# EAGLE design MicroBlue_1.0_rdob-millable (EAGLE 6.6.0)
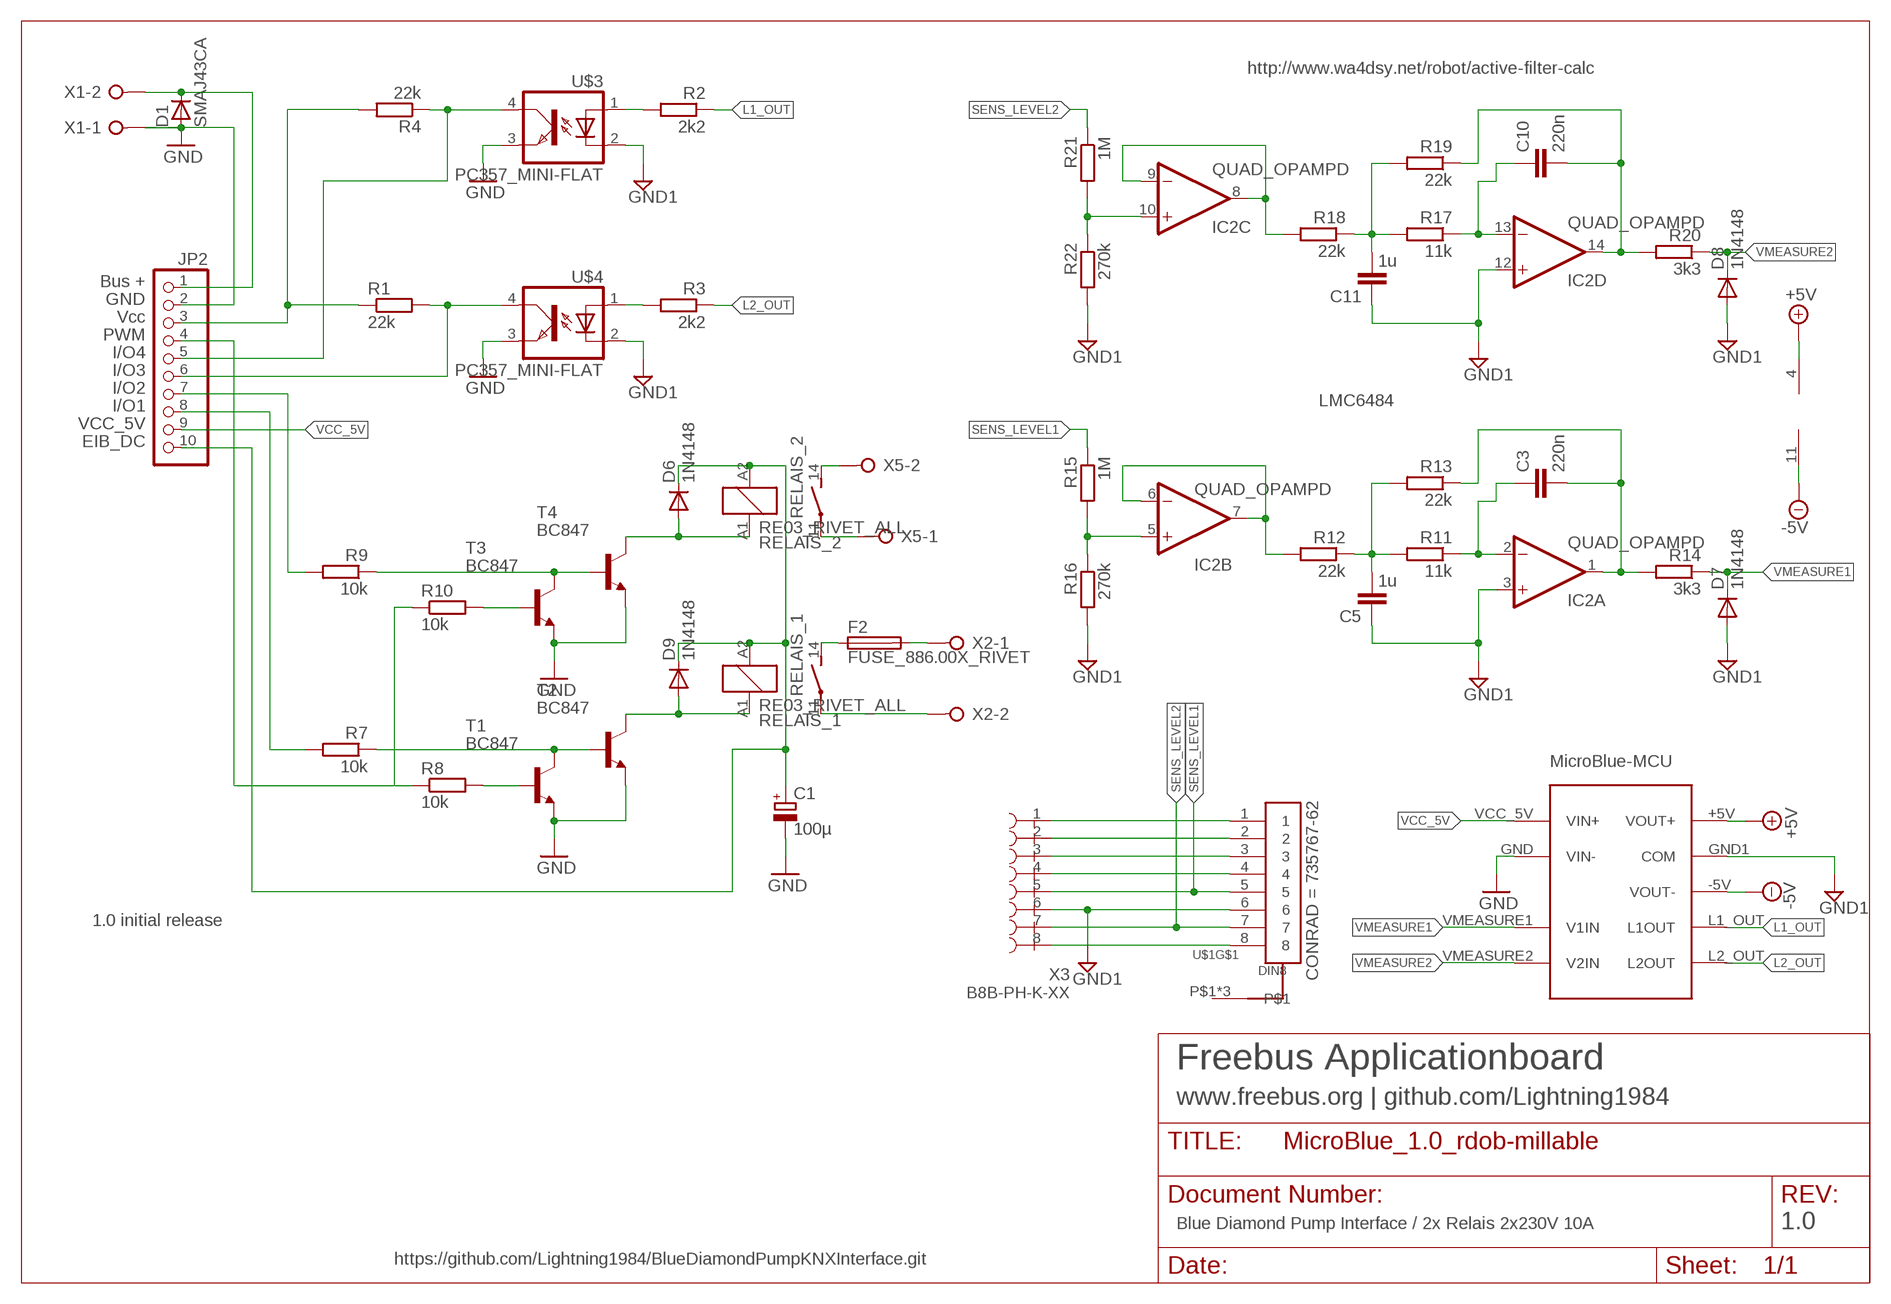
[diagram p0: schematic, sheet 1]

## Parts
C1  100µ  CPOL-EUE3.5-8  [E3,5-8]
C3  220n  C-EUC0805K  [C0805K]
C5  1u  C-EUC0805K  [C0805K]
C10  220n  C-EUC0805K  [C0805K]
C11  1u  C-EUC0805K  [C0805K]
D1  SMAJ43CA  D-SMB  [SMB]
D6  1N4148  DIODE-MINIMELF  [MINIMELF]
D7  1N4148  DIODE-MINIMELF  [MINIMELF]
D8  1N4148  DIODE-MINIMELF  [MINIMELF]
D9  1N4148  DIODE-MINIMELF  [MINIMELF]
F2  FUSE_886.00X_RIVET  [886.00X_RIVET]
IC2  QUAD_OPAMPD  [SO14]
JP2  PINHD-1X10_2.54-S0.90MM-DRILL  [1X10-0.90DRILL]
R1  22k  R-EU_M1206  [M1206]
R2  2k2  R-EU_M1206  [M1206]
R3  2k2  R-EU_M1206  [M1206]
R4  22k  R-EU_M1206  [M1206]
R7  10k  R-EU_M1206  [M1206]
R8  10k  R-EU_M1206  [M1206]
R9  10k  R-EU_M1206  [M1206]
R10  10k  R-EU_M1206  [M1206]
R11  11k  R-EU_M1206  [M1206]
R12  22k  R-EU_M1206  [M1206]
R13  22k  R-EU_M1206  [M1206]
R14  3k3  R-EU_M1206  [M1206]
R15  1M  R-EU_M1206  [M1206]
R16  270k  R-EU_M1206  [M1206]
R17  11k  R-EU_M1206  [M1206]
R18  22k  R-EU_M1206  [M1206]
R19  22k  R-EU_M1206  [M1206]
R20  3k3  R-EU_M1206  [M1206]
R21  1M  R-EU_M1206  [M1206]
R22  270k  R-EU_M1206  [M1206]
RELAIS_1  RE03_RIVET_ALL  [G5Q-SPST-RIVET-ALL]
RELAIS_2  RE03_RIVET_ALL  [G5Q-SPST-RIVET-ALL]
T1  BC847  [SOT23]
T2  BC847  [SOT23]
T3  BC847  [SOT23]
T4  BC847  [SOT23]
U$1  DIN8  [DIN8]
U$3  PC357_MINI-FLAT  [PC357]
U$4  PC357_MINI-FLAT  [PC357]
U$5  MICROBLUE-MCU_V2  [MICROBLUE-MCU-V2]
X1  W237-02PNORMAL  [W237-132]
X2  W237-02P_RIVET  [W237-132-RIVET]
X3  B8B-PH-K-XX  [B8B-PH-K-XX]
X5  W237-02P_RIVET  [W237-132-RIVET]

## Nets
+5V: IC2.4(P:V+) U$5.+5V(VOUT+)
-5V: IC2.11(P:V-) U$5.-5V(VOUT-)
EIB+: D1.1(C) JP2.1 X1.2
EIB_DC: C1.+ D6.C D9.C JP2.10 RELAIS_1.A2 RELAIS_2.A2
GND: C1.- D1.2(A) JP2.2 T1.2(E) T2.2(E) T3.2(E) T4.2(E) U$3.3(EMIT) U$4.3(EMIT) U$5.GND(VIN-) X1.1
GND1: C5.1 C11.1 D7.A D8.A IC2.3(A:+IN) IC2.12(D:+IN) R16.2 R22.2 U$1.6 U$3.2(C) U$4.2(C) U$5.GND1(COM) X3.6
IO1: JP2.7 R9.2
IO2: JP2.8 R7.2
IO3: JP2.6 R1.2 U$4.4(COL)
IO4: JP2.5 R4.1 U$3.4(COL)
L1_OUT: R2.1 U$5.L1_OUT(L1OUT)
L2_OUT: R3.1 U$5.L2_OUT(L2OUT)
N$1: U$1.1 X3.1
N$2: RELAIS_1.11(2:P) X2.2
N$3: U$1.2 X3.2
N$4: U$1.4 X3.4
N$5: U$1.3 X3.3
N$6: F2.1 RELAIS_1.14(2:S)
N$7: U$1.8 X3.8
N$8: RELAIS_2.14(2:S) X5.2
N$9: RELAIS_2.11(2:P) X5.1
N$10: F2.2 X2.1
N$11: C5.2 R11.2 R12.1 R13.2
N$12: R2.2 U$3.1(A)
N$13: R3.2 U$4.1(A)
N$14: R7.1 T1.3(C) T2.1(B)
N$16: C3.2 IC2.1(A:OUT) R13.1 R14.2
N$17: R9.1 T3.3(C) T4.1(B)
N$19: D6.A RELAIS_2.A1 T4.3(C)
N$21: R8.2 T1.1(B)
N$22: R10.2 T3.1(B)
N$23: C3.1 IC2.2(A:-IN) R11.1
N$30: IC2.6(B:-IN) IC2.7(B:OUT) R12.2
N$31: IC2.5(B:+IN) R15.2 R16.1
N$33: C11.2 R17.2 R18.1 R19.2
N$34: C10.2 IC2.14(D:OUT) R19.1 R20.2
N$35: C10.1 IC2.13(D:-IN) R17.1
N$36: IC2.8(C:OUT) IC2.9(C:-IN) R18.2
N$37: IC2.10(C:+IN) R21.2 R22.1
PWM: JP2.4 R8.1 R10.1
R3: D9.A RELAIS_1.A1 T2.3(C)
SENS_LEVEL1: R15.1 U$1.5 X3.5
SENS_LEVEL2: R21.1 U$1.7 X3.7
VCC: JP2.3 R1.1 R4.2
VCC_5V: JP2.9 U$5.VCC_5V(VIN+)
VMEASURE1: D7.C R14.1 U$5.VMEASURE1(V1IN)
VMEASURE2: D8.C R20.1 U$5.VMEASURE2(V2IN)
Unconnected: U$1.P$1 U$1.P$2 U$1.P$3

## Notes on the sheet
- http://www.wa4dsy.net/robot/active-filter-calc
- Bus +
- GND
- Vcc
- PWM
- I/O4
- I/O3
- I/O2
- I/O1
- VCC_5V
- EIB_DC
- 1.0 initial release
- Freebus Applicationboard
- www.freebus.org | github.com/Lightning1984
- Blue Diamond Pump Interface / 2x Relais 2x230V 10A | 1.0
- https://github.com/Lightning1984/BlueDiamondPumpKNXInterface.git

## Library data of the parts
C1 = rcl:CPOL-EU: POLARIZED CAPACITOR, European symbol
C3 C5 C10 C11 = rcl:C-EU: CAPACITOR, European symbol
D1 = semicon-smd-ipc:D-: DIODE unfilled
D6-D9 = diode:DIODE-: DIODE
F2 = rdob-devices:FUSE: various fuses
IC2 = adafruit-2:QUAD_OPAMP: OP AMP Standard quad package; TYPE: LMC6484
JP2 = pinhead-2:PINHD-1X10: PIN HEADER
R1-R4 R7-R22 = rcl:R-EU_: RESISTOR, European symbol
RELAIS_1 RELAIS_2 = relay-modified:RE03*: Miniature PCB Relay 1 pole 6 A SCHRACK Source: http://www.schrack.com/.. 5812.pdf
T1-T4 = transistor:BC847: NPN TRANSISTOR
U$1 = rdob-devices:DIN8; CONRAD: 735767-62
U$3 U$4 = optocoupler:PC357
U$5 = rdob-devices:MICROBLUE-MCU
X1 = con-wago-508:W237-02P: WAGO SREW CLAMP; OC_FARNELL: unknown; OC_NEWARK: unknown
X2 X5 = con-wago-508:W237-02P: WAGO SREW CLAMP
X3 = jst_2.0mm:B8B-PH-K-XX: JST PH Family Series Connector Manufacturer: JST Grid: 2.00mm Farbendeklaration Der letzte (bzw. die letzten) zwei Ziffern beschreiben die Farbe des Steckers. z.B.: B2B-PH-K-xx: S ... natural (white) K ... black R ... red TR ... tomato red E ... blue Y ... yellow L ... lemon yellow M ... green O ... orange N ... brown P ... purple PK ... pink H ... gray LE ... light blue FY ... vivid yellow (blank) ... ivory

## Board
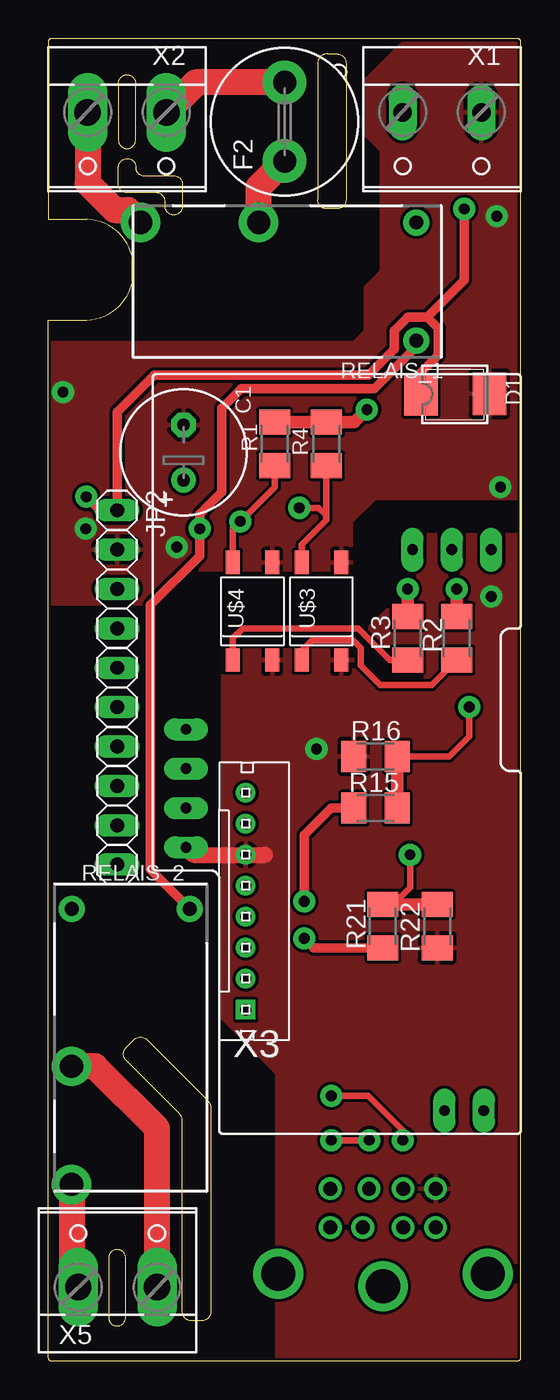
[diagram p1: board, top side]
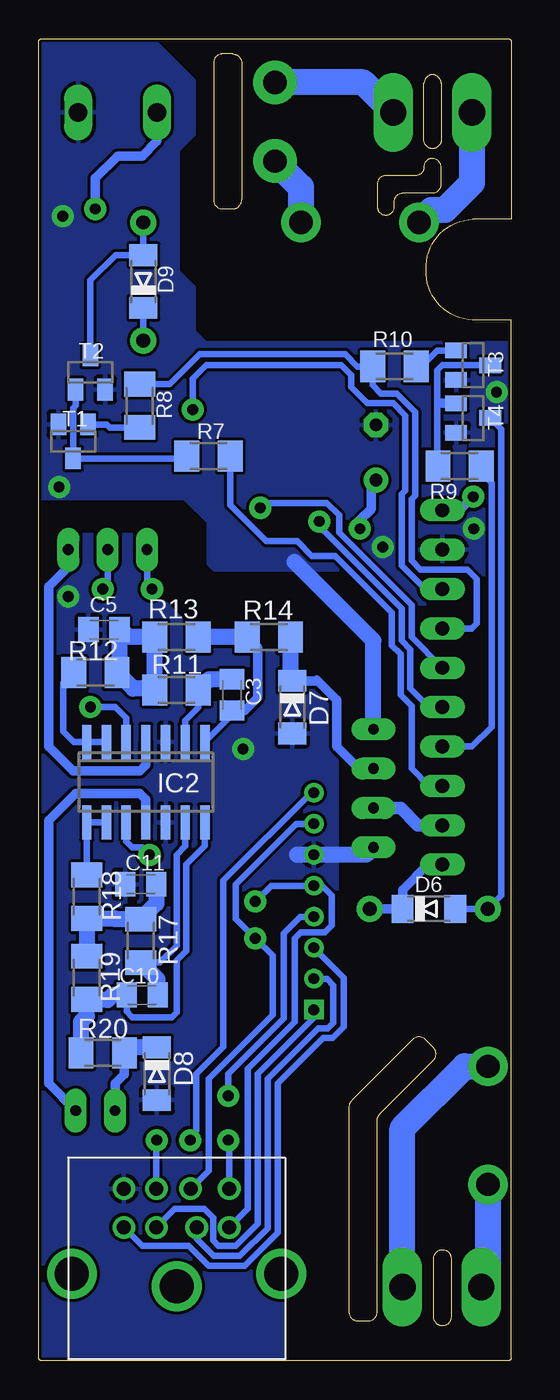
[diagram p2: board, bottom side, seen from below]

Size 30.48 x 85.3 mm. Coordinates in mm from the lower left corner, seen from the top.
Outline: 0,0.2 0,67.15 2.5,67.15 arc90 5.5,70.4 arc90 2.5,73.65 0,73.65 0,85.1 arc-90 0.2,85.3 30.28,85.3 arc-90 30.48,85.1 30.48,0.2 arc-90 30.28,0 0.2,0 arc-90 0,0.2
Copper layers (1*16): Top 0.035mm / dielectric 1.5mm / Bottom 0.035mm
Design rules "default_freebus *": minimum track width 12mil, minimum drill 0.5mm, track to track 0.2mm, track to pad 0.2mm, pad to pad 0.2mm, via to via 0.2mm, smd to smd 0.2mm, copper to edge 0.2mm, drill to drill 8mil, minimum pad ring 11mil, minimum via ring 8mil, stop-mask expansion 4mil, vias tented up to drill 0mil, thermal gap 10mil
tRestrict: area -0.3,65.8 to 23.2,85.5; area -0.3,-0.2 to 30.8,55.5
bRestrict: area -0.3,65.8 to 23.2,85.5; area -0.3,-0.2 to 30.8,55.5
Milling: 51 lines

### Footprints (pad centres in the part's own frame; a part is rotated, then mirrored left to right if it is on the bottom)
E3,5-8 = drill 0.813 pad 1.6: + -1.778,0 | drill 0.813 pad 1.6 octagon: - 1.778,0
C0805K = smd 1.3 x 1.6: 1 -1,0; 2 1,0
SMB = smd 2.159 x 2.743: 1 -2.311,-0.127; 2 2.108,-0.102
MINIMELF = smd 1.4 x 1.8: A 1.7,0; C -1.7,0
886.00X_RIVET = drill 1.5 pad 2.8: 1 -2.54,0; 2 2.54,0
SO14 = smd 0.6 x 2.2: 1 -3.81,-2.6; 2 -2.54,-2.6; 3 -1.27,-2.6; 4 0,-2.6; 5 1.27,-2.6; 6 2.54,-2.6; 7 3.81,-2.6; 8 3.81,2.6; 9 2.54,2.6; 10 1.27,2.6; 11 0,2.6; 12 -1.27,2.6; 13 -2.54,2.6; 14 -3.81,2.6
1X10-0.90DRILL = drill 0.9 pad 1.422 long: 1 -11.43,0; 2 -8.89,0; 3 -6.35,0; 4 -3.81,0; 5 -1.27,0; 6 1.27,0; 7 3.81,0; 8 6.35,0; 9 8.89,0; 10 11.43,0
M1206 = smd 1.6 x 2: 1 -1.4,0; 2 1.4,0
G5Q-SPST-RIVET-ALL = drill 1.5 pad 2.54: 11 8.89,-3.81; 14 1.27,-3.81 | drill 0.9 pad 1.676: A1 -8.89,-3.81; A2 -8.89,3.81
SOT23 = smd 1 x 1.4: 1 -0.95,-1.1; 2 0.95,-1.1; 3 0,1.1
DIN8 = drill 0.9: 1 1.3,8.5; 2 -1.3,8.5; 3 3.4,8.5; 4 1.3,11; 5 -3.4,8.5; 6 3.4,11; 7 -0.9,11; 8 -3.4,11 | drill 2.2: P$1 0,4.7; P$2 -6.75,5.5; P$3 6.75,5.5
PC357 = smd 0.9 x 1.5: 1 -1.27,-3.15; 2 1.27,-3.15; 3 1.27,3.15; 4 -1.27,3.15
MICROBLUE-MCU-V2 = drill 0.7 pad 1.422 long: +5V 13.335,9.684; -5V 12.859,-26.511; GND -6.35,-1.905; GND1 -6.35,-9.525; L1_OUT 10.795,9.684; L2_OUT 8.255,9.684; VCC_5V -6.35,-6.985; VMEASURE1 -6.35,-4.445; VMEASURE2 10.319,-26.511
W237-132 = drill 1.194 long: 1 -2.54,0; 2 2.54,0
W237-132-RIVET = drill 1.7 pad 1.93 long: 1 -2.54,0; 2 2.54,0
B8B-PH-K-XX = drill 0.7 square: 1 0,0 | drill 0.7: 2 2,0; 3 4,0; 4 6,0; 5 8,0; 6 10,0; 7 12,0; 8 14,0

### Placement (x,y rotation side)
C1  8.73,58.6 90 top
C3  18.02,42.97 270 bottom
C5  26.27,47.17 0 bottom
C10  23.81,23.6 180 bottom
C11  23.89,30.74 0 bottom
D1  26.35,62.49 0 top
D6  5.32,29.16 0 bottom
D7  14.13,42.17 270 bottom
D8  22.86,18.52 270 bottom
D9  23.73,69.64 90 bottom
F2  15.25,79.95 90 top
IC2  23.57,37.33 180 bottom
JP2  4.45,43.44 270 top
R1  14.61,59.16 270 top
R2  26.35,46.62 270 top
R3  23.18,46.62 270 top
R4  17.94,59.16 90 top
R7  19.53,58.37 0 bottom
R8  23.97,61.62 270 bottom
R9  3.33,57.73 0 bottom
R10  7.54,64.16 0 bottom
R11  21.59,43.28 180 bottom
R12  26.83,44.4 180 bottom
R13  21.59,46.7 180 bottom
R14  15.64,46.7 180 bottom
R15  21.11,35.66 0 top
R16  21.11,39 180 top
R17  23.89,27.09 90 bottom
R18  27.38,29.95 90 bottom
R19  27.38,24.71 90 bottom
R20  26.35,19.87 180 bottom
R21  21.59,28.04 90 top
R22  25.08,28.04 270 top
RELAIS_1  14.84,69.64 180 top
RELAIS_2  5.32,20.27 270 top
T1  28.26,59.32 180 bottom
T2  27.15,63.76 0 bottom
T3  2.46,64.24 270 bottom
T4  2.46,60.83 270 bottom
U$1  21.59,0.1 0 top
U$3  17.62,48.36 0 top
U$4  13.18,48.36 0 top
U$5  15.24,42.65 0 top
X1  25.4,80.55 180 top
X2  5.08,80.55 180 top
X3  12.74,22.65 90 top
X5  4.48,4.75 0 top

### Tracks (layer width: path | path; a pad name or v marks a point on that pad's centre or on a via)
+5V
  Bottom 0.61: IC2.4 23.57,38.44 23.97,38.05 28.26,38.05 29.84,39.63 29.84,49.95 28.58,51.22 U$5.+5V
-5V
  Bottom 0.61: IC2.11 23.57,36.22 23.97,36.62 28.1,36.62 29.84,34.87 29.84,17.88 U$5.-5V
EIB+  (via drill 0.7 pad 1.42)
  Top 0.61: 24.45,67.34 23.18,67.34 22.3,66.46 22.3,65.27 20.64,63.6 6.83,63.6 4.45,61.22 JP2.1 3.33,54.87 v2.46,55.75 | 24.45,67.34 25.16,66.62 25.16,64.88 24.04,63.75 D1.1 | v26.83,74.32 26.83,69.72 24.45,67.34
  Bottom 0.61: v2.46,55.75 3.33,54.87 JP2.1 | X1.2 22.86,78.69 23.81,77.73 25.4,77.73 26.83,76.31 v26.83,74.32
EIB_DC  (via drill 0.7 pad 1.42)
  Top 0.61: RELAIS_2.A2 6.59,31.7 6.59,48.76 9.76,51.94 v9.76,53.68 9.76,54.64 11.19,56.06 11.19,61.46 12.46,62.73 21.03,62.73 23.73,65.43 RELAIS_1.A2
  Bottom 0.406: RELAIS_1.A2 D9.C
  Bottom 0.61: RELAIS_2.A2 D6.C 7.02,30.39 5.4,32.01 JP2.10 | v9.76,53.68 9.76,54.24 9.05,54.95 9.05,56.51 C1.+
GND  (via drill 0.7 pad 1.42)
  Bottom 1.016: U$5.GND 8.89,46.46 13.97,51.54
  other vias: 2.42,53.68 8.29,52.49 28.93,73.84 0.95,62.49 29.17,56.38
  pour Top: 20.32,82.66 20.32,66.46 19.69,65.83 -0.32,65.83 -0.32,48.68 6.35,48.68 8.57,50.91 19.21,50.91 19.69,51.38 19.69,54.08 21.11,55.51 30.8,55.51 30.8,85.83 23.5,85.83
  pour Bottom: 20.32,82.66 20.32,66.46 19.69,65.83 -0.32,65.83 -0.32,48.68 6.35,48.68 8.57,50.91 19.21,50.91 19.69,51.38 19.69,54.08 21.11,55.51 30.8,55.51 30.8,85.83 23.5,85.83
GND1  (via drill 0.7 pad 1.42)
  Top 1.016: U$5.GND1 9.37,32.65 13.97,32.65
  Bottom 1.016: U$5.GND1 9.37,32.65 X3.6 | 12.7,32.65 13.81,32.65
  other vias: 28.58,49.32 17.3,39.48
  pour Top: 11.11,45.51 11.59,45.98 19.21,45.98 22.38,49.16 22.38,52.81 23.02,53.45 30.8,53.45 30.8,-0.21 14.76,-0.21 14.61,-0.05 14.61,18.52 11.11,22.01
  pour Bottom: 11.11,45.51 11.59,45.98 19.21,45.98 22.38,49.16 22.38,52.81 23.02,53.45 30.8,53.45 30.8,-0.21 14.76,-0.21 14.61,-0.05 14.61,18.52 11.11,22.01
IO1
  Bottom 0.406: JP2.7 2.54,39.63 1.27,40.9 1.27,56.62 1.9,57.25 | 1.9,57.25 2.25,57.6 | 1.9,57.25 1.9,57.7 R9.2
IO2
  Bottom 0.406: JP2.8 5.32,37.09 6.43,38.2 6.43,42.25 7.14,42.97 7.14,45.59 7.7,46.14 7.7,48.29 11.35,51.94 12.86,51.94 13.81,52.89 15.8,52.89 18.13,55.22 R7.2
IO3  (via drill 0.7 pad 1.42)
  Top 0.406: U$4.4 11.91,53.68 v12.38,54.16 14.61,56.38 R1.2
  Bottom 0.406: JP2.6 5.32,42.17 6.51,43.36 6.51,45.9 7.06,46.46 7.06,48.52 12.38,53.84 v12.38,54.16
IO4  (via drill 0.7 pad 1.42)
  Top 0.406: U$3.4 16.35,52.65 17.94,54.24 17.94,54.56 | 17.94,54.56 R4.1 | v16.19,55.03 17.46,55.03 17.94,54.56
  Bottom 0.406: JP2.5 6.43,46.7 6.43,48.76 11.11,53.45 11.11,54.56 11.91,55.35 15.88,55.35 v16.19,55.03
L1_OUT  (via drill 0.7 pad 1.42)
  Top 0.813: R2.1 v26.35,49.79
  Bottom 0.406: U$5.L1_OUT 26.04,50.11 v26.35,49.79
L2_OUT  (via drill 0.7 pad 1.42)
  Top 0.813: v23.18,49.79 R3.1
  Bottom 0.406: U$5.L2_OUT 23.5,50.11 v23.18,49.79
N$1
  Bottom 0.406: X3.1 12.74,22.13 16.35,18.52 16.35,8.84 17.78,7.41 18.89,7.41 19.24,7.76 19.24,9.23 19.79,9.79 21.71,9.79 U$1.1
N$2
  Top 1.676: X2.2 2.54,75.99 4.29,74.24 5.16,74.24 RELAIS_1.11
  Bottom 1.676: X2.2 2.54,75.99 4.29,74.24 5.16,74.24 5.4,74 RELAIS_1.11
N$3
  Bottom 0.406: X3.2 11.89,24.65 11.47,24.23 11.47,21.81 11.83,21.46 12.46,21.46 15.72,18.2 15.72,8.56 17.5,6.77 19.21,6.77 20.29,7.85 U$1.2
N$4  (via drill 0.7 pad 1.42)
  Top 0.406: v18.26,17.09 20.64,17.09 22.86,14.87 v22.86,14.23
  Bottom 0.406: X3.4 13.6,28.65 14.68,27.57 14.68,22.09 18.26,18.52 v18.26,17.09 | U$1.4 22.89,14.2 v22.86,14.23
N$5
  Bottom 0.406: U$1.3 23.79,7.41 20.8,7.41 19.53,6.14 17.18,6.14 15.08,8.24 15.08,17.88 12.14,20.82 11.51,20.82 10.79,21.54 10.79,24.7 X3.3
N$6
  Top 1.676: RELAIS_1.14 13.57,75.74 F2.1
  Bottom 1.676: F2.1 13.57,75.73 RELAIS_1.14
N$7  (via drill 0.7 pad 1.42)
  Top 0.406: v18.26,14.23 v20.72,14.23
  Bottom 0.406: U$1.8 18.19,14.17 v18.26,14.23 | v20.72,14.23 20.72,14.47 20.32,14.87 20.32,18.52 18.57,20.27 18.57,30.98 12.91,36.65 X3.8
N$8
  Top 1.676: X5.2 7.02,14.99 3.02,19 1.35,19
  Bottom 1.676: X5.2 7.02,14.99 3.02,19 RELAIS_2.14
N$9
  Top 1.676: RELAIS_2.11 1.51,5.18 1.98,4.71
  Bottom 1.676: RELAIS_2.11 1.51,5.18 X5.1
N$10
  Top 1.676: X2.1 9.51,82.44 | F2.2 9.51,82.49 7.65,80.62
  Bottom 1.676: X2.1 9.56,82.49 F2.2
N$11
  Bottom 0.406: 23.15,43.36 23.07,43.28 R11.2
  Bottom 1.016: C5.2 25.27,44.55 R12.1 24.4,43.36 23.15,43.36 22.99,43.52 R13.2 24.69,46.7 25.24,47.25
N$12
  Top 0.406: U$3.1 16.35,45.82 16.99,46.46 19.69,46.46 20.16,45.98 20.16,44.87 21.43,43.6 24.74,43.6 R2.2
N$13
  Top 0.406: U$4.1 11.91,46.62 12.54,47.25 20,47.25 22.04,45.22 R3.2
N$14
  Bottom 0.406: T2.1 28.1,61.62 28.26,61.46 T1.3 21.07,58.22 R7.1
N$16
  Bottom 0.406: C3.2 18.02,41.68 IC2.1
  Bottom 0.61: R14.2 16.35,46.01 16.35,42.81 17.19,41.97 C3.2
  Bottom 1.016: R14.2 R13.1
N$17
  Bottom 0.406: 4.76,61.78 4.76,63.92 4.45,64.24 T3.3 | 4.76,61.78 4.76,57.89 4.73,57.86 R9.1 | T4.1 4.76,61.78
  Bottom 0.61: T4.1 4.6,61.78
N$19
  Bottom 0.406: D6.A RELAIS_2.A1 0.63,30.03 0.63,60.11 T4.3
N$21
  Bottom 0.406: R8.2 25.91,60.22 26.1,60.42 T1.1
N$22
  Bottom 0.406: T3.1 4.77,65.19 5.79,64.16 R10.2
N$23
  Bottom 0.406: 20.16,43.17 20.16,43.26 R11.1 20.19,42.14 21.03,41.3 IC2.2 | 20.16,43.17 | 20.16,43.17 20.16,43.13
  Bottom 1.016: C3.1 19.51,43.97 R11.1
N$30
  Bottom 0.406: IC2.6 IC2.7 28.24,39.93 28.89,40.59 28.89,43.73 R12.2
N$31  (via drill 0.7 pad 1.42)
  Top 0.406: v27.15,42.17 27.15,40.27 25.88,39 R16.1
  Top 0.813: R16.1 R15.2
  Bottom 0.406: IC2.5 24.84,41.46 25.56,42.17 v27.15,42.17
N$33
  Bottom 1.016: R19.2 R18.1 25.59,28.55 25.53,28.49 R17.2 22.89,29.49 C11.2
N$34
  Bottom 0.406: C10.2 24.81,22.54 24.45,22.17 21.91,22.17 21.59,22.49 21.59,25.82 20.95,26.46 20.95,32.01 19.76,33.2 IC2.14
  Bottom 1.016: R20.2 27.75,21.88 27.38,22.25 R19.1 27.36,23.28 26.04,23.28 25.72,23.6 C10.2
N$35
  Bottom 0.406: R17.1 22.67,25.69 21.59,26.77 21.59,32.65 21.03,33.2 IC2.13
  Bottom 1.016: C10.1 22.81,24.61 R17.1
N$36
  Bottom 0.406: IC2.9 IC2.8 R18.2
N$37  (via drill 0.7 pad 1.42)
  Top 0.406: v23.34,32.65 23.34,30.56 22.23,29.45
  Top 0.813: R21.2 22.23,29.45 R22.1
  Bottom 0.406: IC2.10 24.84,33.52 24.45,33.12 23.81,33.12 v23.34,32.65
PWM
  Bottom 0.406: JP2.4 2.54,47.25 2.22,47.57 2.22,50.43 2.86,51.06 5.87,51.06 6.43,51.62 6.43,55.59 6.19,55.83 6.19,61.22 7.38,62.41 8.41,62.41 8.94,62.94 R10.1 9.92,64.16 10.72,64.95 20.08,64.95 22.02,63.02 R8.1 24.01,63.06 24.01,63.17 | 24.05,63.13 24.01,63.17 | 24.01,63.17 23.97,63.21
R3
  Bottom 0.406: RELAIS_1.A1 D9.A 25.53,71.34 27.15,69.72 T2.3
SENS_LEVEL1  (via drill 0.7 pad 1.42)
  Top 0.61: v16.51,29.63 16.51,33.92 18.26,35.66 R15.1
  Bottom 0.406: U$1.5 16.99,9.81 16.99,18.84 13.97,21.85 13.97,27.25 13.57,27.65 12.04,27.65 11.59,28.1 11.59,30.03 12.21,30.65 X3.5 15.49,30.65 v16.51,29.63
SENS_LEVEL2  (via drill 0.7 pad 1.42)
  Top 0.61: R21.1 17.12,26.64 v16.51,27.25
  Bottom 0.406: X3.7 13.87,34.65 17.78,30.74 17.78,28.52 v16.51,27.25 15.4,26.14 15.4,22.33 19.53,18.2 19.53,12.27 U$1.7
VCC  (via drill 0.7 pad 1.42)
  Top 0.813: R1.1 R4.2 19.74,60.56 v20.56,61.38
  Bottom 0.406: JP2.3 5.56,49.79 7.06,51.3 7.06,55.91 6.83,56.14 6.83,60.99 7.62,61.78 9.29,61.78 10.32,62.81 10.32,63.6 10.95,64.24 19.69,64.24 20.56,63.37 v20.56,61.38
VCC_5V
  Bottom 0.813: JP2.9 6.03,34.55 7.14,35.66 U$5.VCC_5V
VMEASURE1
  Bottom 0.406: 12.54,43.92 12.59,43.87 | D7.C 14.24,43.98
  Bottom 0.61: U$5.VMEASURE1 9.84,38.2 11.27,39.63 11.27,42.65 12.54,43.92 | 12.59,43.87 D7.C
  Bottom 1.016: 14.24,43.98 R14.1
VMEASURE2
  Bottom 0.61: U$5.VMEASURE2 25.56,17.88 24.95,18.49 R20.1
  Bottom 0.813: R20.1 24.95,20.03 24.76,20.22
  Bottom 1.016: D8.C 24.76,20.22

### Text on the board
Document: Selfbus KNX 2in-2out Interface / for Blue Diamond Microblue Condensate Pump / Ver. 1.0 by Rupert Dobrounig / 02.11.2016 / https://github.com/Lightning1984/BlueDiamondPumpKNXInterface.git
tText: KNX 2in2out / Blue Diamond / Pump IF / mod RDOB / 02.11.2016 v1.0